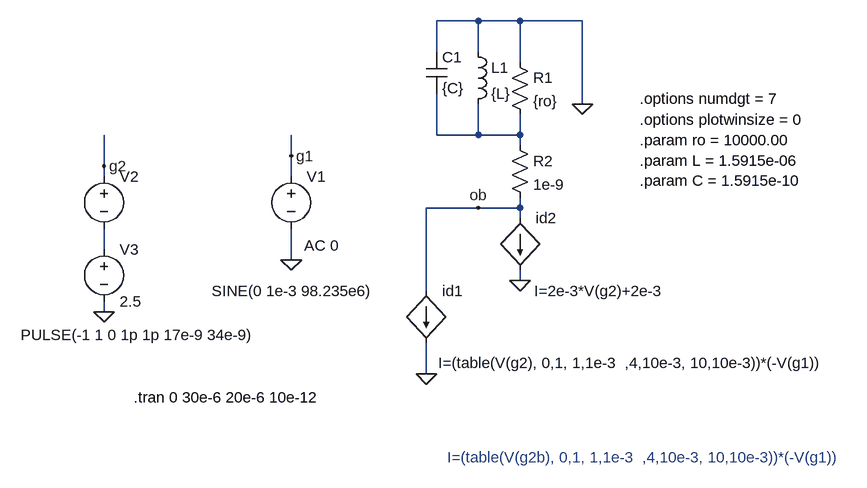
[diagram p0: schematic dual_clase.asc]
dual_clase.asc, the LTspice schematic file:
Version 4
SHEET 1 1020 680
WIRE 368 -448 304 -448
WIRE 432 -448 368 -448
WIRE 528 -448 432 -448
WIRE 304 -400 304 -448
WIRE 368 -400 368 -448
WIRE 432 -384 432 -448
WIRE 528 -320 528 -448
WIRE 304 -272 304 -336
WIRE 368 -272 368 -320
WIRE 368 -272 304 -272
WIRE 432 -272 432 -304
WIRE 432 -272 368 -272
WIRE 432 -256 432 -272
WIRE 80 -240 80 -272
WIRE -208 -224 -208 -272
WIRE -208 -208 -208 -224
WIRE 80 -208 80 -240
WIRE 368 -160 288 -160
WIRE 432 -160 432 -176
WIRE 432 -160 368 -160
WIRE 432 -144 432 -160
WIRE -208 -96 -208 -128
WIRE 80 -80 80 -128
WIRE 432 -48 432 -64
WIRE 288 -32 288 -160
WIRE -208 0 -208 -16
WIRE 288 96 288 48
FLAG 80 -80 0
FLAG 80 -240 g1
FLAG -208 0 0
FLAG -208 -224 g2
FLAG 288 96 0
FLAG 368 -160 ob
FLAG 432 -48 0
FLAG 528 -320 0
SYMBOL voltage 80 -224 R0
WINDOW 3 -122 192 Left 2
WINDOW 123 20 122 Left 2
WINDOW 39 0 0 Left 0
SYMATTR InstName V1
SYMATTR Value SINE(0 1e-3 98.235e6)
SYMATTR Value2 AC 0
SYMBOL voltage -208 -224 R0
WINDOW 3 -128 260 Left 2
WINDOW 123 24 124 Left 2
WINDOW 39 0 0 Left 0
SYMATTR InstName V2
SYMATTR Value PULSE(-1 1 0 1p 1p 17e-9 34e-9)
SYMBOL bi 288 -32 R0
WINDOW 3 18 111 Left 2
SYMATTR Value I=(table(V(g2), 0,1, 1,1e-3  ,4,10e-3, 10,10e-3))*(-V(g1))
SYMATTR InstName id1
SYMBOL bi 432 -144 R0
WINDOW 3 22 112 Left 2
SYMATTR Value I=2e-3*V(g2)+2e-3
SYMATTR InstName id2
SYMBOL res 416 -400 R0
SYMATTR InstName R1
SYMATTR Value {ro}
SYMBOL voltage -208 -112 R0
WINDOW 123 0 0 Left 0
WINDOW 39 0 0 Left 0
SYMATTR InstName V3
SYMATTR Value 2.5
SYMBOL ind 352 -416 R0
SYMATTR InstName L1
SYMATTR Value {L}
SYMATTR SpiceLine Rser=1e-12
SYMBOL cap 288 -400 R0
SYMATTR InstName C1
SYMATTR Value {C}
SYMBOL res 416 -272 R0
SYMATTR InstName R2
SYMATTR Value 1e-9
TEXT -162 132 Left 2 !.tran 0 30e-6 20e-6 10e-12
TEXT 616 -328 Left 2 !.options numdgt = 7
TEXT 616 -296 Left 2 !.options plotwinsize = 0
TEXT 616 -264 Left 2 !.param ro = 10000.00\n.param L = 1.5915e-06\n.param C = 1.5915e-10
TEXT 320 224 Left 2 ;I=(table(V(g2b), 0,1, 1,1e-3  ,4,10e-3, 10,10e-3))*(-V(g1))

The netlist it stands for:
* dual_clase.asc
V1 g1 0 SINE(0 1e-3 98.235e6) AC 0
V2 g2 N002 PULSE(-1 1 0 1p 1p 17e-9 34e-9)
B§id1 ob 0 I=(table(V(g2), 0,1, 1,1e-3  ,4,10e-3, 10,10e-3))*(-V(g1))
B§id2 ob 0 I=2e-3*V(g2)+2e-3
R1 0 N001 {ro}
V3 N002 0 2.5
L1 0 N001 {L} Rser=1e-12
C1 0 N001 {C}
R2 N001 ob 1e-9
.tran 0 30e-6 20e-6 10e-12
.options numdgt = 7
.options plotwinsize = 0
.param ro = 10000.00
.param L = 1.5915e-06
.param C = 1.5915e-10
* I=(table(V(g2b), 0,1, 1,1e-3  ,4,10e-3, 10,10e-3))*(-V(g1))
.backanno
.end